# EAGLE design ledPower (EAGLE 6.6.0)
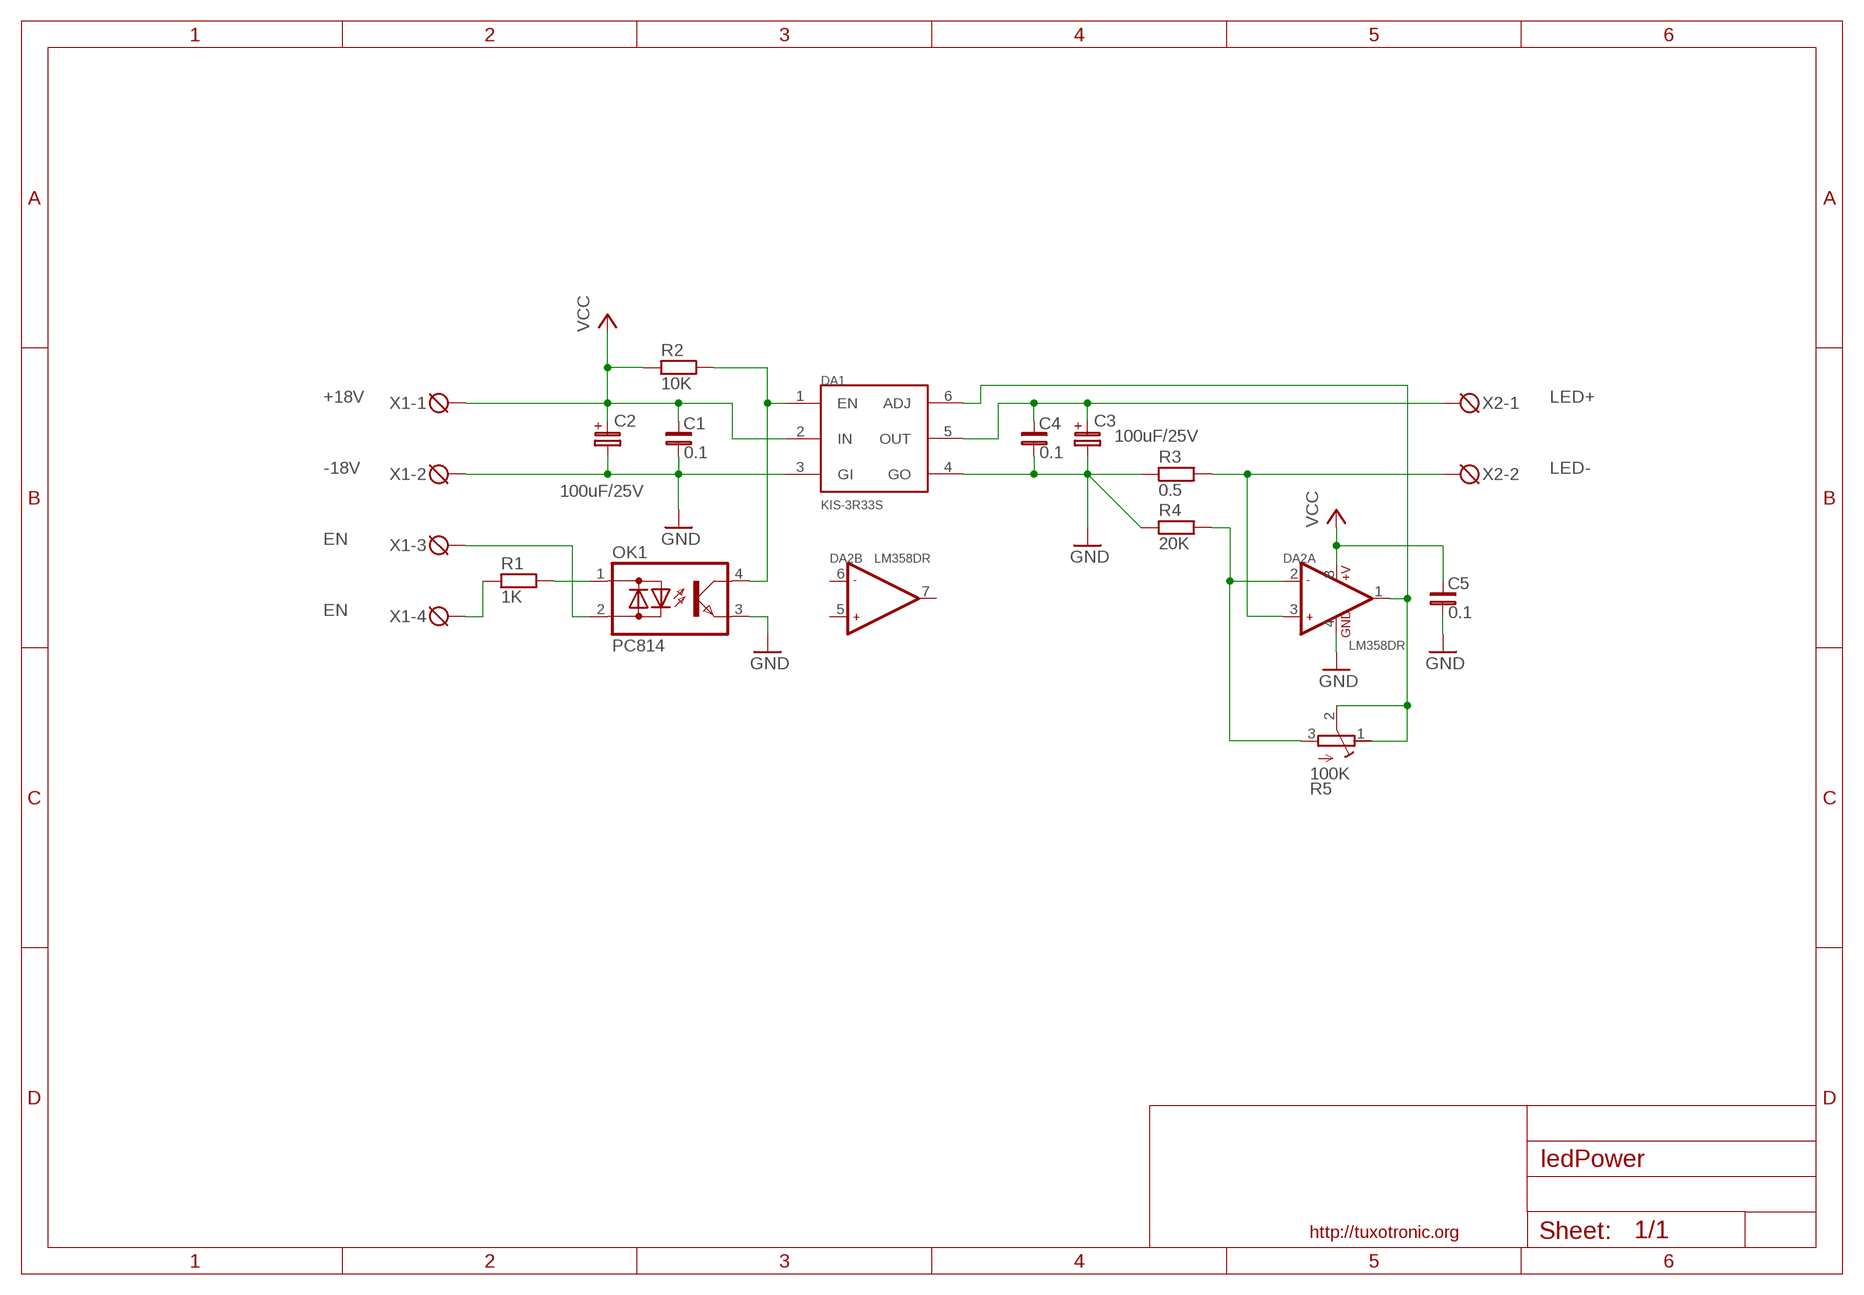
[diagram p0: schematic, sheet 1]

## Parts
C1  0.1  C_1206  [C1206]
C2  100uF/25V  CP_E-025X060  [CE-025X060]
C3  100uF/25V  CP_E-025X060  [CE-025X060]
C4  0.1  C_1206  [C1206]
C5  0.1  C_0805  [C0805]
DA1  KIS-3R33S  [KIS-3R33S]
DA2  LM358DR  LM358DR-1110010P1  [SOIC8]
OK1  PC814  [DIL04]
R1  1K  R_0805  [R0805]
R2  10K  R_0805  [R0805]
R3  0.5  R_X0414/15  [0414/15]
R4  20K  R_0805  [R0805]
R5  100K  R-TRIMMT93YA  [RTRIMT93YA]
X1  DG3XX-04-0.5  [DG306-5.0-04P]
X2  DG3XX-02-5.0  [DG306-5.0-02P]

## Nets
GND: C1.2 C2.- C3.- C4.2 C5.2 DA1.3(GI) DA1.4(GO) DA2.4(A:GND) OK1.3(E) R3.1 R4.1 X1.2
N$1: R1.1 X1.4
N$2: C3.+ C4.1 DA1.5(OUT) X2.1
N$3: DA1.1(EN) OK1.4(C) R2.2
N$4: OK1.1(AC1) R1.2
N$5: OK1.2(AC2) X1.3
N$7: DA2.3(A:+IN1) R3.2 X2.2
N$8: DA2.2(A:-IN1) R4.2 R5.3(E)
N$9: DA1.6(ADJ) DA2.1(A:OUT1) R5.1(A) R5.2(S)
VCC: C1.1 C2.+ C5.1 DA1.2(IN) DA2.8(A:+V) R2.1 X1.1
Unconnected: DA2.5(B:+IN2) DA2.6(B:-IN2) DA2.7(B:OUT2)

## Notes on the sheet
- +18V | LED+
- -18V | LED-
- EN
- EN

## Library data of the parts
C1 C4 C5 = rc-master:C_: NON-POLARIZED CAP
C2 C3 = rc-master:CP_: POLARIZED CAP
DA1 = KIS-3R33S:KIS-3R33S: DC-DC Converter
DA2 = OPL:LM358DR: General purpose LOW Voltage, Rail-to-Rail Output Amplifiers http://www.fairchildsemi.com/ds/LM/LMV358.pdf
OK1 = optocoupler:PC814: SHARP OPTO COUPLER; OC_FARNELL: 9707662; OC_NEWARK: unknown
R1-R4 = rc-master:R_: RESISTOR
R5 = resistor:R-TRIMM: Trimm resistor
X1 = degson:DG3XX-04: DG350-3.5-04P DG306-5.0-04P
X2 = degson:DG3XX-02: DG350-3.5-02P DG306-5.0-02P

## Board
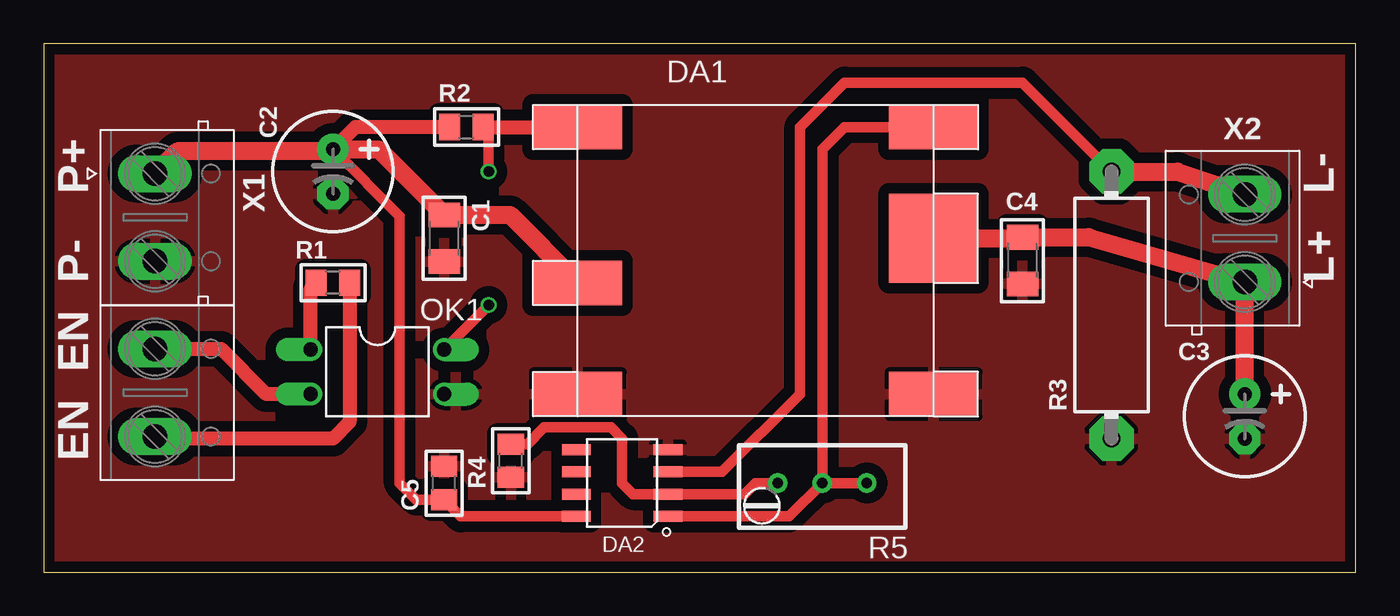
[diagram p1: board, top side]
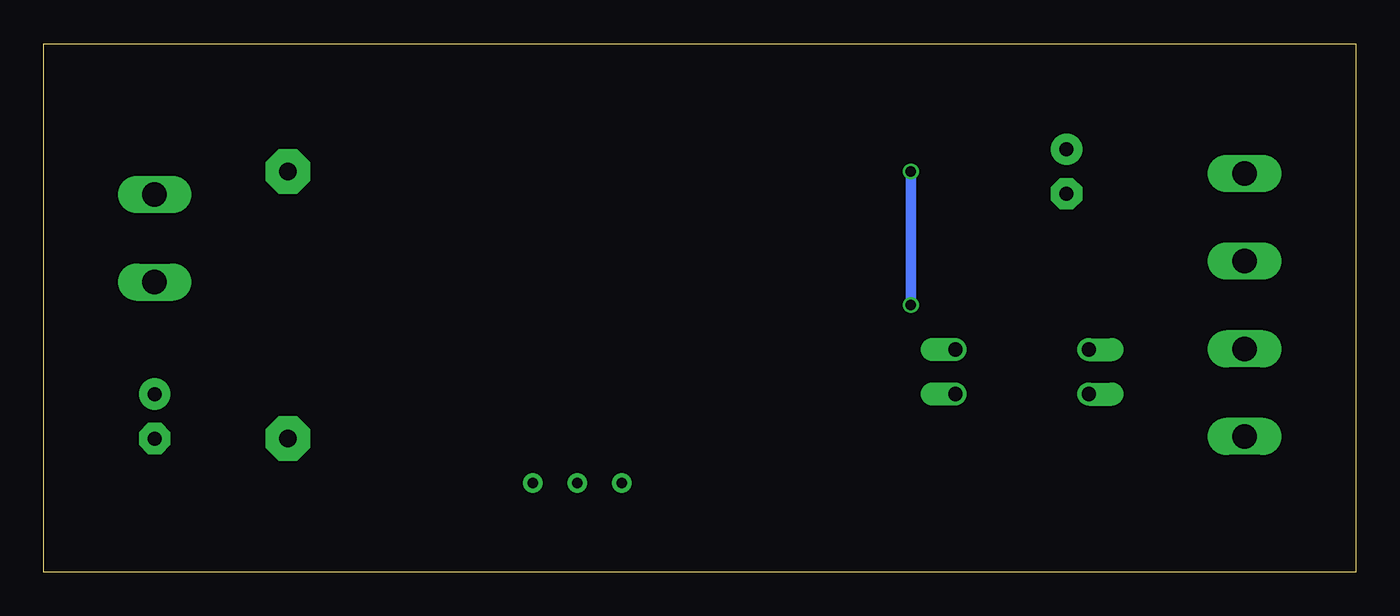
[diagram p2: board, bottom side, seen from below]

Size 74.91 x 30.15 mm. Coordinates in mm from the lower left corner, seen from the top.
Outline: 0,0 74.91,0 74.91,30.15 0,30.15 0,0
Copper layers (1*16): Top 0.035mm / dielectric 1.5mm / Bottom 0.035mm
Design rules "ITEADstudio_DRC": minimum track width 6mil, minimum drill 12mil, track to track 6mil, track to pad 6mil, pad to pad 6mil, via to via 6mil, smd to smd 0mil, copper to edge 10mil, drill to drill 10mil, minimum pad ring 10mil, minimum via ring 6mil, stop-mask expansion 2mil, vias tented up to drill 100mil, thermal gap 10mil

### Footprints (pad centres in the part's own frame; a part is rotated, then mirrored left to right if it is on the bottom)
C1206 = smd 1.4 x 1.8: 1 -1.329,0; 2 1.329,0
CE-025X060 = drill 0.8 pad 1.778: + -1.27,0 | drill 0.8 pad 1.778 octagon: - 1.27,0
C0805 = smd 1.2 x 1.5: 1 -0.953,0; 2 0.953,0
KIS-3R33S = smd 5.08 x 2.54: 1 10.16,-7.62; 2 10.16,1.27; 3 10.16,7.62; 4 -10.16,7.62; 6 -10.16,-7.62 | smd 5.08 x 5.08: 5 -10.16,-1.27
SOIC8 = smd 1.651 x 0.635: 1 -2.616,1.905; 2 -2.616,0.635; 3 -2.616,-0.635; 4 -2.616,-1.905; 5 2.616,-1.905; 6 2.616,-0.635; 7 2.616,0.635; 8 2.616,1.905
DIL04 = drill 0.813 offset: 1 -1.27,-3.81; 2 1.27,-3.81; 3 1.27,3.81; 4 -1.27,3.81
R0805 = smd 1.2 x 1.5: 1 -0.953,0; 2 0.953,0
0414/15 = drill 1 pad 2.54 octagon: 1 -7.62,0; 2 7.62,0
RTRIMT93YA = drill 0.61: 1 0,-2.54; 2 0,0; 3 0,2.54
DG306-5.0-04P = drill 1.4 long: 1 -7.5,0; 2 -2.5,0; 3 2.5,0; 4 7.5,0
DG306-5.0-02P = drill 1.4 long: 1 -2.5,0; 2 2.5,0

### Placement (x,y rotation side)
C1  22.86,19.05 270 top
C2  16.51,22.86 270 top
C3  68.58,8.89 270 top
C4  55.88,17.78 270 top
C5  22.86,5.08 90 top
DA1  40.64,17.78 180 top
DA2  33.02,5.08 180 top
OK1  19.05,11.43 270 top
R1  16.51,16.51 180 top
R2  24.13,25.4 0 top
R3  60.96,15.24 90 top
R4  26.67,6.35 90 top
R5  44.45,5.08 90 top
X1  6.35,15.24 270 top
X2  68.58,19.05 90 top

### Tracks (layer width: path | path; a pad name or v marks a point on that pad's centre or on a via)
GND
  pour Top (isolate 0.61, rank 5): -1.27,31.75 76.2,31.75 76.2,-1.27 -1.27,-1.27
N$1
  Top 0.813: R1.1 17.46,8.57 16.51,7.62 6.47,7.62 X1.4
N$2
  Top 0.813: 55.82,19.05 C4.1
  Top 1.016: C3.+ X2.1 59.67,19.11 C4.1 | DA1.5 55.82,19.05
N$3  (via drill 0.6)
  Top 0.61: OK1.4 v25.4,15.24 | v25.4,22.86 25.4,25.08 R2.2
  Top 0.813: R2.2 DA1.1
  Bottom 0.61: v25.4,15.24 v25.4,22.86
N$4
  Top 0.813: OK1.1 15.24,16.19 R1.2
N$5
  Top 0.813: OK1.2 12.7,10.16 10.12,12.74 X1.3
N$7
  Top 0.61: DA2.3 38.73,5.71 43.18,10.16 43.18,25.4 45.72,27.94 55.88,27.94 R3.2
  Top 1.016: R3.2 64.73,22.86 X2.2
N$8
  Top 0.61: R5.3 40.64,5.08 40.01,4.45 DA2.2 33.66,4.45 33.02,5.08 33.02,7.62 32.38,8.26 28.57,8.26 27.62,7.3 R4.2
N$9
  Top 0.61: DA2.1 42.55,3.17 R5.2 | R5.1 R5.2 | DA1.6 45.72,25.4 44.45,24.13 R5.2
VCC
  Top 0.61: DA2.8 23.81,3.17 C5.1 21.27,4.13 20.32,5.08 20.32,20.32 C2.+
  Top 0.813: 16.39,24.01 C2.+ 17.78,25.4 R2.1
  Top 1.016: DA1.2 26.61,20.38 C1.1 19.11,24.13 C2.+ | 16.39,24.01 7.62,24.01 X1.1

### Text on the board
tNames: P+ | L- | P- | L+ | EN | EN